# Altium schematic sheet 1.SchDoc
size A4
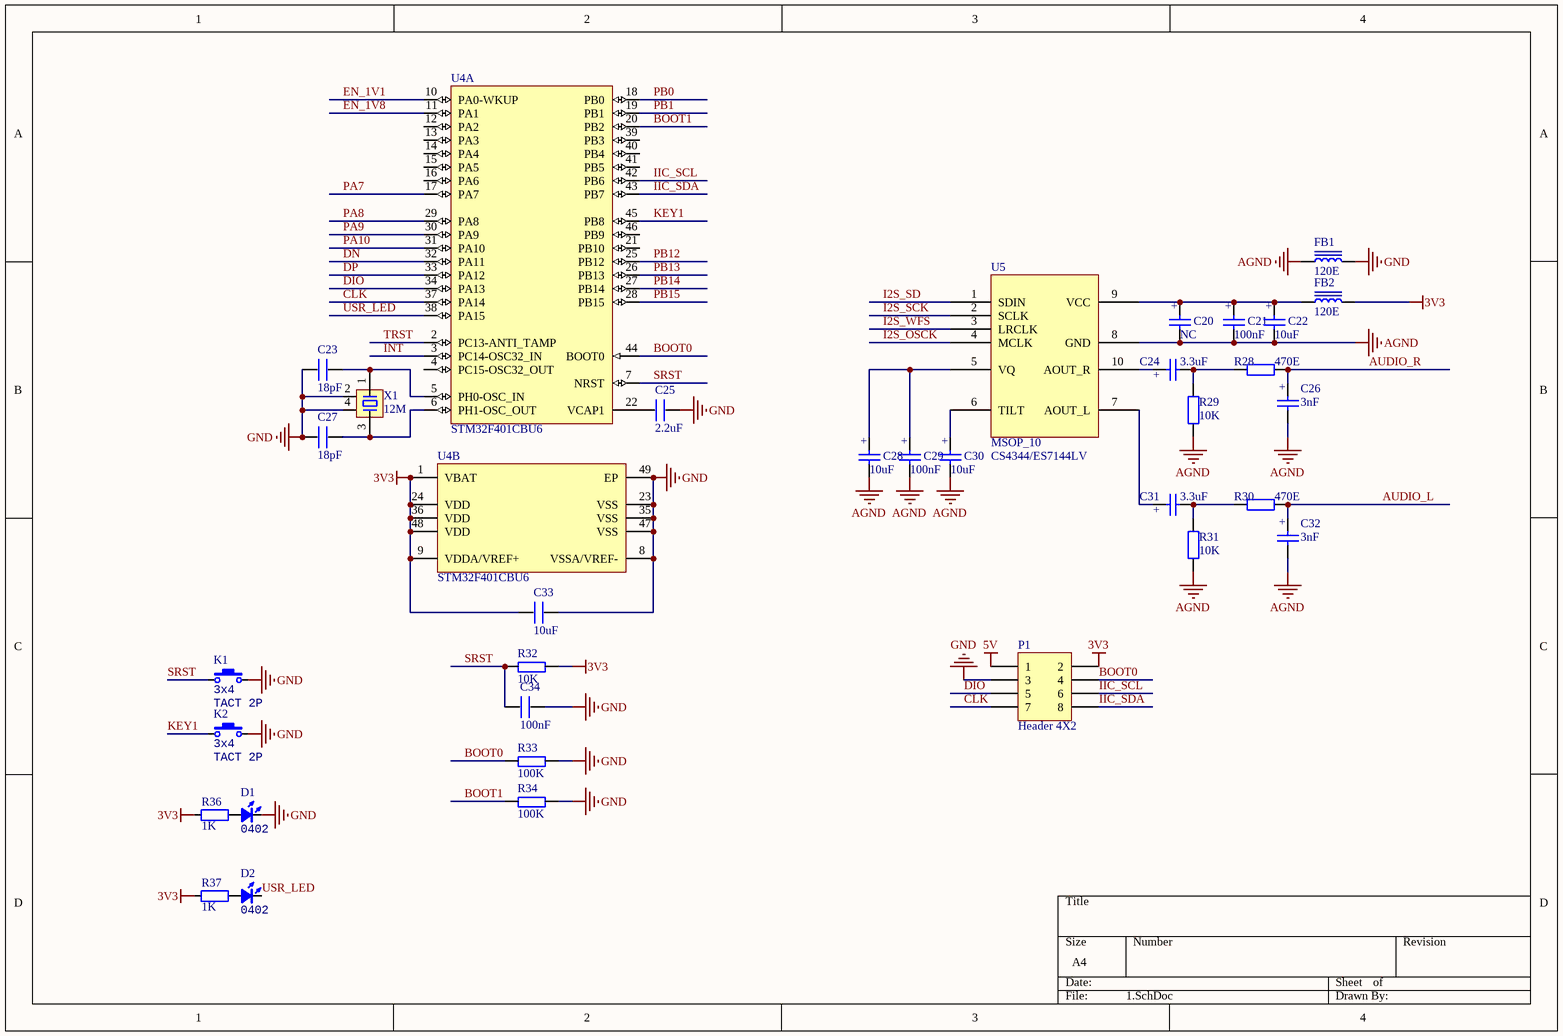
[diagram p0: 1.SchDoc]

## Parts
C20  value NC  [0603_CAP]  (hidden comment: 0402)
C21  value 100nF  [0603_CAP]  (hidden comment: 0402)
C22  value 10uF  [0603_CAP]  (hidden comment: 0603)
C23  18pF  [0603_CAP]
C24  value 3.3uF  [0603_CAP]  (hidden comment: 1206)
C25  2.2uF  [0603_CAP]
C26  value 3nF  [0603_CAP]  (hidden comment: 0603)
C27  18pF  [0603_CAP]
C28  value 10uF  [0603_CAP]  (hidden comment: 0603)
C29  value 100nF  [0603_CAP]  (hidden comment: 0402)
C30  value 10uF  [0603_CAP]  (hidden comment: 0603)
C31  value 3.3uF  [0603_CAP]  (hidden comment: 1206)
C32  value 3nF  [0603_CAP]  (hidden comment: 0603)
C33  10uF  [0603_CAP]
C34  100nF  [0603_CAP]
D1  Type: 0402  [SMDLED-0603]  (hidden comment: color?)
D2  Type: 0402  [SMDLED-0603]  (hidden comment: color?)
FB1  value 120E  [2520-L]  (hidden comment: 0603)
FB2  value 120E  [2520-L]  (hidden comment: 0603)
K1  value 3x4  [ButtonTACT_3x4x2_180H]  (hidden comment: TACT 2P)
K2  value 3x4  [ButtonTACT_3x4x2_180H]  (hidden comment: TACT 2P)
P1  Header 4X2  [HDR2X4]
R28  value 470E  [0603_RES]  (hidden comment: 0603)
R29  value 10K  [0603_RES]  (hidden comment: 0402)
R30  value 470E  [0603_RES]  (hidden comment: 0603)
R31  value 10K  [0603_RES]  (hidden comment: 0402)
R32  10K  [0603_RES]
R33  100K  [0603_RES]
R34  100K  [0603_RES]
R36  1K  [0603_RES]
R37  1K  [0603_RES]
U4  STM32F401CBU6  [401cb]  (parts A,B of 2)
U5  MSOP_10  value CS4344/ES7144LV  [TSSOP-10_L3.0-W3.0-P0.50-LS4.9-BL]
X1  12M  [XTAL3225]

## Nets
3V3: C33.2 FB2.2 P1.2 R32.2 R36.1 R37.1 U4.1(VBAT) U4.9(VDDA/VREF+) U4.24(VDD) U4.36(VDD) U4.48(VDD)
5V: P1.1
AGND: C20.2 C21.2 C22.2 C26.2 C28.2 C29.2 C30.2 C32.2 FB1.1 R29.1 R31.1 U5.8(GND)
GND: C23.2 C25.1 C27.2 C33.1 C34.1 D1.2(K) FB1.2 K1.2 K2.2 P1.3 R33.2 R34.2 U4.8(VSSA/VREF-) U4.23(VSS) U4.35(VSS) U4.47(VSS) U4.49(EP) X1.2 X1.4
AUDIO_L: C32.1(+) R30.1
AUDIO_R: C26.1(+) R28.1
BOOT0: P1.4 R33.1 U4.44(BOOT0)
BOOT1: R34.1 U4.20(PB2)
CLK: P1.7 U4.37(PA14)
DIO: P1.5 U4.34(PA13)
DN: U4.32(PA11)
DP: U4.33(PA12)
EN_1V1: U4.10(PA0-WKUP)
EN_1V8: U4.11(PA1)
I2S_OSCK: U5.4(MCLK)
I2S_SCK: U5.2(SCLK)
I2S_SD: U5.1(SDIN)
I2S_WFS: U5.3(LRCLK)
IIC_SCL: P1.6 U4.42(PB6)
IIC_SDA: P1.8 U4.43(PB7)
INT: U4.3(PC14-OSC32_IN)
KEY1: K2.1 U4.45(PB8)
PA7: U4.17(PA7)
PA8: U4.29(PA8)
PA9: U4.30(PA9)
PA10: U4.31(PA10)
PB0: U4.18(PB0)
PB1: U4.19(PB1)
PB12: U4.25(PB12)
PB13: U4.26(PB13)
PB14: U4.27(PB14)
PB15: U4.28(PB15)
SRST: C34.2 K1.1 R32.1 U4.7(NRST)
TRST: U4.2(PC13-ANTI_TAMP)
USR_LED: D2.2(K) U4.38(PA15)
NetC20_1: C20.1(+) C21.1(+) C22.1(+) FB2.1 U5.9(VCC)
NetC23_1: C23.1 U4.5(PH0-OSC_IN) X1.1
NetC24_1: C24.1(+) U5.10(AOUT_R)
NetC24_2: C24.2 R28.2 R29.2
NetC25_2: C25.2 U4.22(VCAP1)
NetC27_1: C27.1 U4.6(PH1-OSC_OUT) X1.3
NetC28_1: C28.1(+) C29.1(+) U5.5(VQ)
NetC30_1: C30.1(+) U5.6(TILT)
NetC31_1: C31.1(+) U5.7(AOUT_L)
NetC31_2: C31.2 R30.2 R31.2
NetD1_1: D1.1(A) R36.2
NetD2_1: D2.1(A) R37.2

Not connected (* = marked no-connect by the designer): U4 4(PC15-OSC32_OUT) 12(PA2) 13(PA3) 14(PA4) 15(PA5) 16(PA6) 21(PB10) 39(PB3) 40(PB4) 41(PB5) 46(PB9)

## Library data of the parts
C20-C22 C24 C26 C28-C32 = Cap: 电容; Published: 8-Jun-2000; LatestRevisionDate: 17-Jul-2002; LatestRevisionNote: Re-released for DXP Platform.; PackageReference: RAD-0.3; Publisher: Altium Limited; PackageDescription: Radial Cap, Thru-Hole; 2 Leads; 0.3 in Pin Spacing
C23 C25 C27 C33 C34 = C
D1 D2 = LED_0402: LED; Value: color?
FB1 FB2 = FB: 磁珠; Code_IEC: 1005; Published: 8-Jun-2000; LatestRevisionDate: 29-May-2009; LatestRevisionNote: IPC-7351 Footprint Added.; PackageReference: 0402-A; Publisher: Altium Limited; PackageDescription: Chip Inductor; Code_JEITA: 0402
K1 K2 = ButtonTACT_3x4x2_180: Button; type: TACT 2P
P1 = Header 4X2: Header, 4-Pin, Dual row; LatestRevisionDate: 17-Jul-2002; LatestRevisionNote: Re-released for DXP Platform.; Publisher: Altium Limited
R28-R31 = R: 电阻; Published: 8-Jun-2000; LatestRevisionDate: 17-Jul-2002; LatestRevisionNote: Re-released for DXP Platform.; PackageReference: AXIAL-0.4; Publisher: Altium Limited; PackageDescription: Axial Device, Thru-Hole; 2 Leads; 0.4 in Pin Spacing
R32-R34 = R
R36 R37 = 电阻-0402: Resistor; Value: 22R
U4 = STM32F401CBU6: ARM Cortex-M4 32-bit MCU+FPU, 105 DMIPS, 128 kB Flash, 64 kB Internal RAM, 36 I/Os, 48-pin UFQFPN, -40 to 85 degC, Tray; Manufacturer: STMicroelectronics; FLASH Size (Prog) (kB): 128; I/Os (High Current): 36; Internal RAM Size (kB): 64; Operating Frequency(F) (Processor speed) (MHz): 84; Supply Voltage(Vcc) max (V): 3.6; Supply Voltage(Vcc) min (V): 1.8; DatasheetVersion: Rev. 1; PackageVersion: Rev. 1, 04/2013; PackageReference: UFQFPN48; PackageDescription: 48-Pin Ultra Thin Fine Pitch Quad Flat No-Lead, 7 x 7 x 0.6 mm Body, 0.5 mm Pitch, Exposed Pad; Supplier 1: Newark; Supplier Part Number 1: 19X6215; Supplier 2: Mouser; Supplier Part Number 2: 511-STM32F401CBU6; Core: ARM Cortex-M4; Packing: Tray; Mounting Technology: Surface Mount; PartNumber: STM32F401CBU6; ComponentLink1Description: Manufacturer URL; ComponentLink1URL: http://www.st.com/web/en/home.html; ComponentLink2Description: Datasheet; ComponentLink2URL: http://www.st.com/st-web-ui/static/active/en/resource/technical/document/data_brief/DM00071938.pdf; ComponentLink3Description: Package Specification; ComponentLink3URL: http://www.st.com/st-web-ui/static/active/en/resource/technical/document/data_brief/DM00071938.pdf
U5 = CS4344: DAC
X1 = XTAL-4P: 4脚无源晶振; 版权归属: 源创客; BOM名称: 4脚无源晶振; 学习资源: www.ooocke.com